# EAGLE design 11A-01 (EAGLE 6.3)
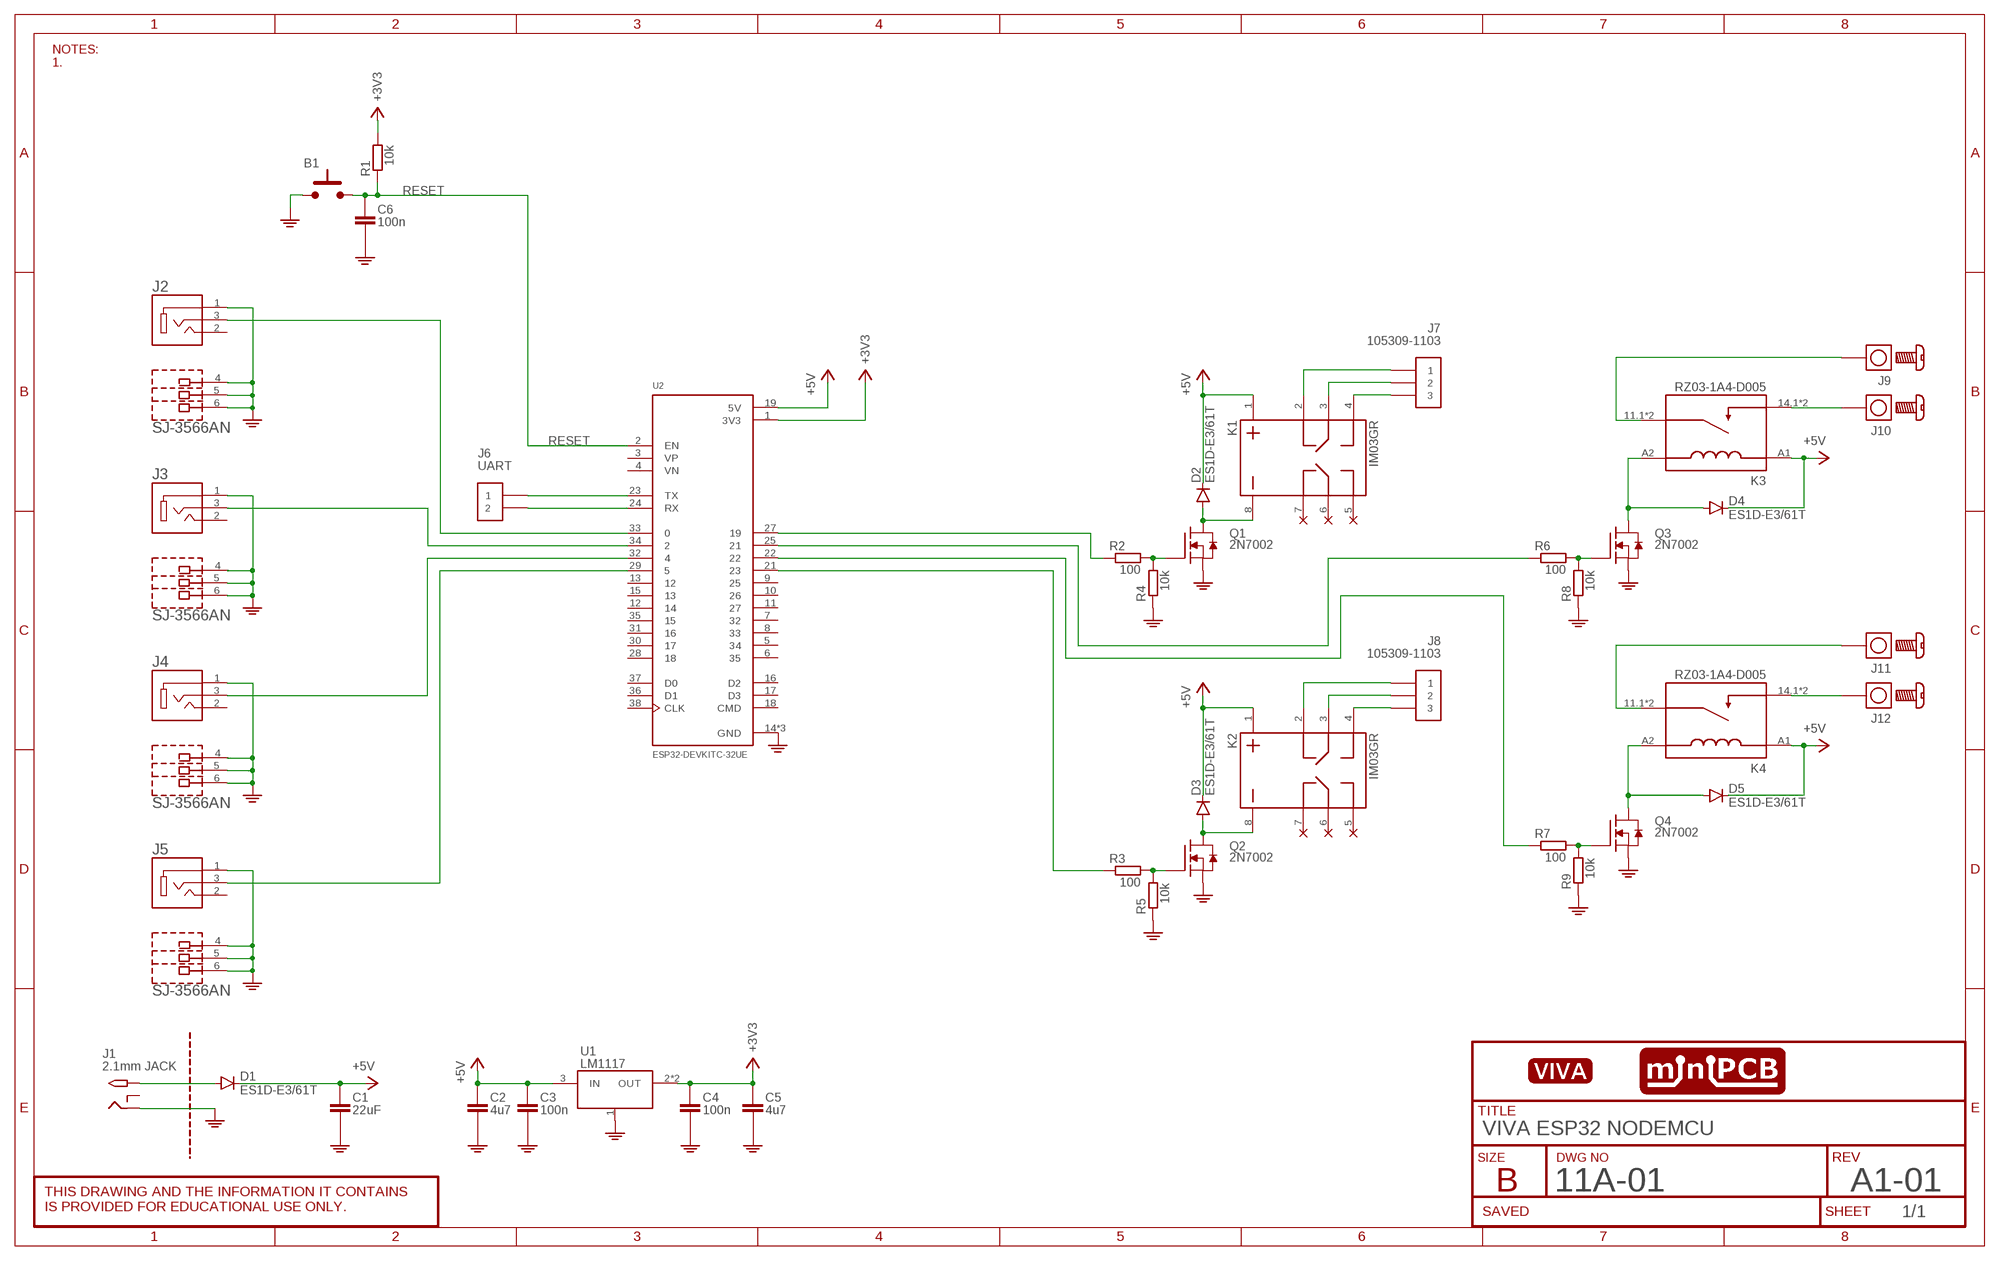
[diagram p0: schematic, sheet 1]
SHEET1 (SCHEMATIC): DWG_NO: 11A-01; REV: A1-01; TITLE: VIVA ESP32 NODEMCU

## Parts
B1  PUSHBUTTON6MMSMD  [PUSHBUTTON-6MM-SMD]
C1  22uF  CAPACITOR3.5MM  [C3-5MM]
C2  4u7  CAPACITORSMD  [C0805]
C3  100n  CAPACITORSMD  [C0805]
C4  100n  CAPACITORSMD  [C0805]
C5  4u7  CAPACITORSMD  [C0805]
C6  100n  CAPACITORSMD  [C0805]
D1  ES1D-E3/61T  DIODESMD  [DO214AC]
D2  ES1D-E3/61T  DIODESMD  [DO214AC]
D3  ES1D-E3/61T  DIODESMD  [DO214AC]
D4  ES1D-E3/61T  DIODESMD  [DO214AC]
D5  ES1D-E3/61T  DIODESMD  [DO214AC]
J1  2.1mm JACK  2.1MMJACKTHM  [PJ-102A]
J2  SJ-3566AN  [CUI_SJ-3566AN]
J3  SJ-3566AN  [CUI_SJ-3566AN]
J4  SJ-3566AN  [CUI_SJ-3566AN]
J5  SJ-3566AN  [CUI_SJ-3566AN]
J6  UART  PINS_2  [PINS_2]
J7  105309-1103  PINS_3-NANOFIT-105309-1103  [PINS_3-NANOFIT]
J8  105309-1103  PINS_3-NANOFIT-105309-1103  [PINS_3-NANOFIT]
J9  SCREW-TERMINAL  [SCREW-TERMINAL-M3]
J10  SCREW-TERMINAL  [SCREW-TERMINAL-M3]
J11  SCREW-TERMINAL  [SCREW-TERMINAL-M3]
J12  SCREW-TERMINAL  [SCREW-TERMINAL-M3]
K1  IM03GR  [RELAY_IM03GR]
K2  IM03GR  [RELAY_IM03GR]
K3  RZ03-1A4-D005  [RELAY_RZ03-1A4-D005]
K4  RZ03-1A4-D005  [RELAY_RZ03-1A4-D005]
PCB1  MINIPCB_0P100X100  [MINIPCB_DOCK_100X100]
Q1  2N7002  MOSFET-NSOT23  [SOT23]
Q2  2N7002  MOSFET-NSOT23  [SOT23]
Q3  2N7002  MOSFET-NSOT23  [SOT23]
Q4  2N7002  MOSFET-NSOT23  [SOT23]
R1  10k  RESISTORSMD  [R0805]
R2  100  RESISTORSMD  [R0805]
R3  100  RESISTORSMD  [R0805]
R4  10k  RESISTORSMD  [R0805]
R5  10k  RESISTORSMD  [R0805]
R6  100  RESISTORSMD  [R0805]
R7  100  RESISTORSMD  [R0805]
R8  10k  RESISTORSMD  [R0805]
R9  10k  RESISTORSMD  [R0805]
U1  LM1117  REGULATOR_SCHLM1117  [SOT223]
U2  ESP32-DEVKITC-32UE  [ESPRESSIF_ESP32-DEVKITC-32UE]
U$1  VIVA_LOGO  [VIVA_LOGO]

## Nets
+3V3: C4.1ASD(+) C5.1ASD(+) R1.2 U1.2(OUT) U1.4.TAB(OUT)
+5V: C1.+ C2.1ASD(+) C3.1ASD(+) D1.C D2.C D3.C D4.C D5.C K1.1 K2.1 K3.A1 K4.A1 U1.3(IN)
GND: B1.1 B1.2 C1.- C2.2ASDF(-) C3.2ASDF(-) C4.2ASDF(-) C5.2ASDF(-) C6.2ASDF(-) J1.RING J2.1 J2.5 J2.6 J3.1 J3.5 J3.6 J4.1 J4.5 J4.6 J5.1 J5.5 J5.6 Q1.2(S) Q2.2(S) Q3.2(S) Q4.2(S) R4.1 R5.1 R8.1 R9.1 U1.1(GND) U2.14(GND) U2.20(GND) U2.26(GND)
N$1: Q1.1(G) R2.2 R4.2
N$2: D4.A K3.A2 Q3.3(D)
N$3: Q3.1(G) R6.2 R8.2
N$4: J10.1 J10.2 J10.3 J10.4 K3.14.1 K3.14.2
N$5: J9.1 J9.2 J9.3 J9.4 K3.11.1 K3.11.2
N$6: D2.A K1.8 Q1.3(D)
N$7: D5.A K4.A2 Q4.3(D)
N$8: Q4.1(G) R7.2 R9.2
N$9: J12.1 J12.2 J12.3 J12.4 K4.14.1 K4.14.2
N$10: J11.1 J11.2 J11.3 J11.4 K4.11.1 K4.11.2
N$11: J7.3 K1.4
N$12: J7.2 K1.3
N$13: J7.1 K1.2
N$14: Q2.1(G) R3.2 R5.2
N$15: D3.A K2.8 Q2.3(D)
N$16: J8.3 K2.4
N$17: J8.2 K2.3
N$18: J8.1 K2.2
N$19: D1.A J1.TIP
N$20: J6.1 U2.23(TX)
N$21: J6.2 U2.24(RX)
N$22: J2.3 U2.33
N$23: J3.3 U2.34
N$24: J4.3 U2.32
N$25: J5.3 U2.29
N$26: R2.1 U2.27
N$27: R6.1 U2.25
N$28: R7.1 U2.22
N$29: R3.1 U2.21
RESET: B1.3 B1.4 C6.1ASD(+) R1.1 U2.2(EN)
Unconnected: J1.RING_SW J2.2 J2.4 J3.2 J3.4 J4.2 J4.4 J5.2 J5.4 K1.5 K1.6 K1.7 K2.5 K2.6 K2.7 U2.3(VP) U2.4(VN) U2.5 U2.6 U2.7 U2.8 U2.9 U2.10 U2.11 U2.12 U2.13 U2.15 U2.16(D2) U2.17(D3) U2.18(CMD) U2.28 U2.30 U2.31 U2.35 U2.36(D1) U2.37(D0) U2.38(CLK)

## Notes on the sheet
- NOTES:
  1.

## Power pins joined to a net without a drawn wire
3V3: U2.1(3V3)
5V: U2.19(5V)

## Library data of the parts
B1 = minipcb:PUSHBUTTON: Tactile push button switch
C1-C6 = minipcb:CAPACITOR
D1-D5 = minipcb:DIODE
J1 = utsa:2.1MMJACK: 2.1mm x 5.5mm THM DC jack with internal switch. Digikey part #PJ-102A, 4UCON part #05537 2.1mm x 5.5mm SMT DC jack with internal switch. Digikey part #PJ-002A-SMT, 4UCON part #03267 By microbuilder.eu & adafruit.com
J2-J5 = SJ-3566AN:SJ-3566AN: Audio Jack Connector 3.5 mm Right-Angle Stereo Jack w/ SPDT Switch Check availability <https://pricing.snapeda.com/parts/SJ-3566AN/Same%20Sky/view-part?ref=eda>; AVAILABILITY: In Stock; CHECK_PRICES: https://www.snapeda.com/parts/SJ-3566AN/Same+Sky/view-part/?ref=eda; DESCRIPTION: 3.5 mm Right-Angle, SPDT Switch, Stereo Audio Jack Connector; MF: Same Sky; MP: SJ-3566AN; PACKAGE: None; PRICE: None; SNAPEDA_LINK: https://www.snapeda.com/parts/SJ-3566AN/Same+Sky/view-part/?ref=snap
J6 = minipcb:PINS_2
J7 J8 = minipcb:PINS_3
J9-J12 = minipcb:SCREW-TERMINAL; CIRCUIT_CATEGORY: CIRCUIT CATEGORY; REVISION: A1; TITLE: TITLE
K1 K2 = IM03GR:IM03GR: Electromechanical Relay 5VDC 178Ohm 2A DPDT (( 10mm 7.5mm 5.65mm)) SMD Signal Relay Automotive Check availability <https://pricing.snapeda.com/parts/IM03GR/TE%20Connectivity%20Potter%20%26%20Brumfield%20Relays/view-part?ref=eda>; AVAILABILITY: In Stock; CHECK_PRICES: https://www.snapeda.com/parts/IM03GR/TE+Connectivity/view-part/?ref=eda; DESCRIPTION: Telecom Relay DPDT (2 Form C) Surface Mount; MF: TE Connectivity Potter & Brumfield Relays; MP: IM03GR; PACKAGE: None; PRICE: None; SNAPEDA_LINK: https://www.snapeda.com/parts/IM03GR/TE+Connectivity/view-part/?ref=snap
K3 K4 = RZ03-1A4-D005:RZ03-1A4-D005: Shrack; Relay Power PCB 16A SPST-NO 5VDC Check availability <https://pricing.snapeda.com/parts/RZ03-1A4-D005/TE%20Connectivity/view-part?ref=eda>; AVAILABILITY: In Stock; CHECK_PRICES: https://www.snapeda.com/parts/RZ03-1A4-D005/TE+Connectivity+Potter+%2526+Brumfield+Relays/view-part/?ref=eda; DESCRIPTION: Shrack, Relay Power PCB 16A SPST-NO 5VDC | TE Connectivity RZ03-1A4-D005; MF: TE Connectivity; MP: RZ03-1A4-D005; PACKAGE: None; PRICE: None; SNAPEDA_LINK: https://www.snapeda.com/parts/RZ03-1A4-D005/TE+Connectivity+Potter+%2526+Brumfield+Relays/view-part/?ref=snap
PCB1 = minipcb:MINIPCB_0P; CIRCUIT_CATEGORY: COMPUTING, EDUCATIONAL; PART_NUMBER: 11A-01; REVISION: A1-01; TITLE: VIVA ESP32 NODEMCU
Q1-Q4 = minipcb:MOSFET-N
R1-R9 = minipcb:RESISTOR
U1 = utsa:REGULATOR_SCH: Linear Regulator in SOT-223 package. NOTE: select correct pinout for your application. Tab may be OUT or GND!
U2 = ESP32-DEVKITC-32UE:ESP32-DEVKITC-32UE; MANUFACTURER: Espressif; MAXIMUM_PACKAGE_HEIGHT: N/A; PARTREV: V4; SNAPEDA_PN: ESP32-DEVKITC-32UE; STANDARD: Manufacturer Recommendations
U$1 = utsa:VIVA_LOGO

## Board
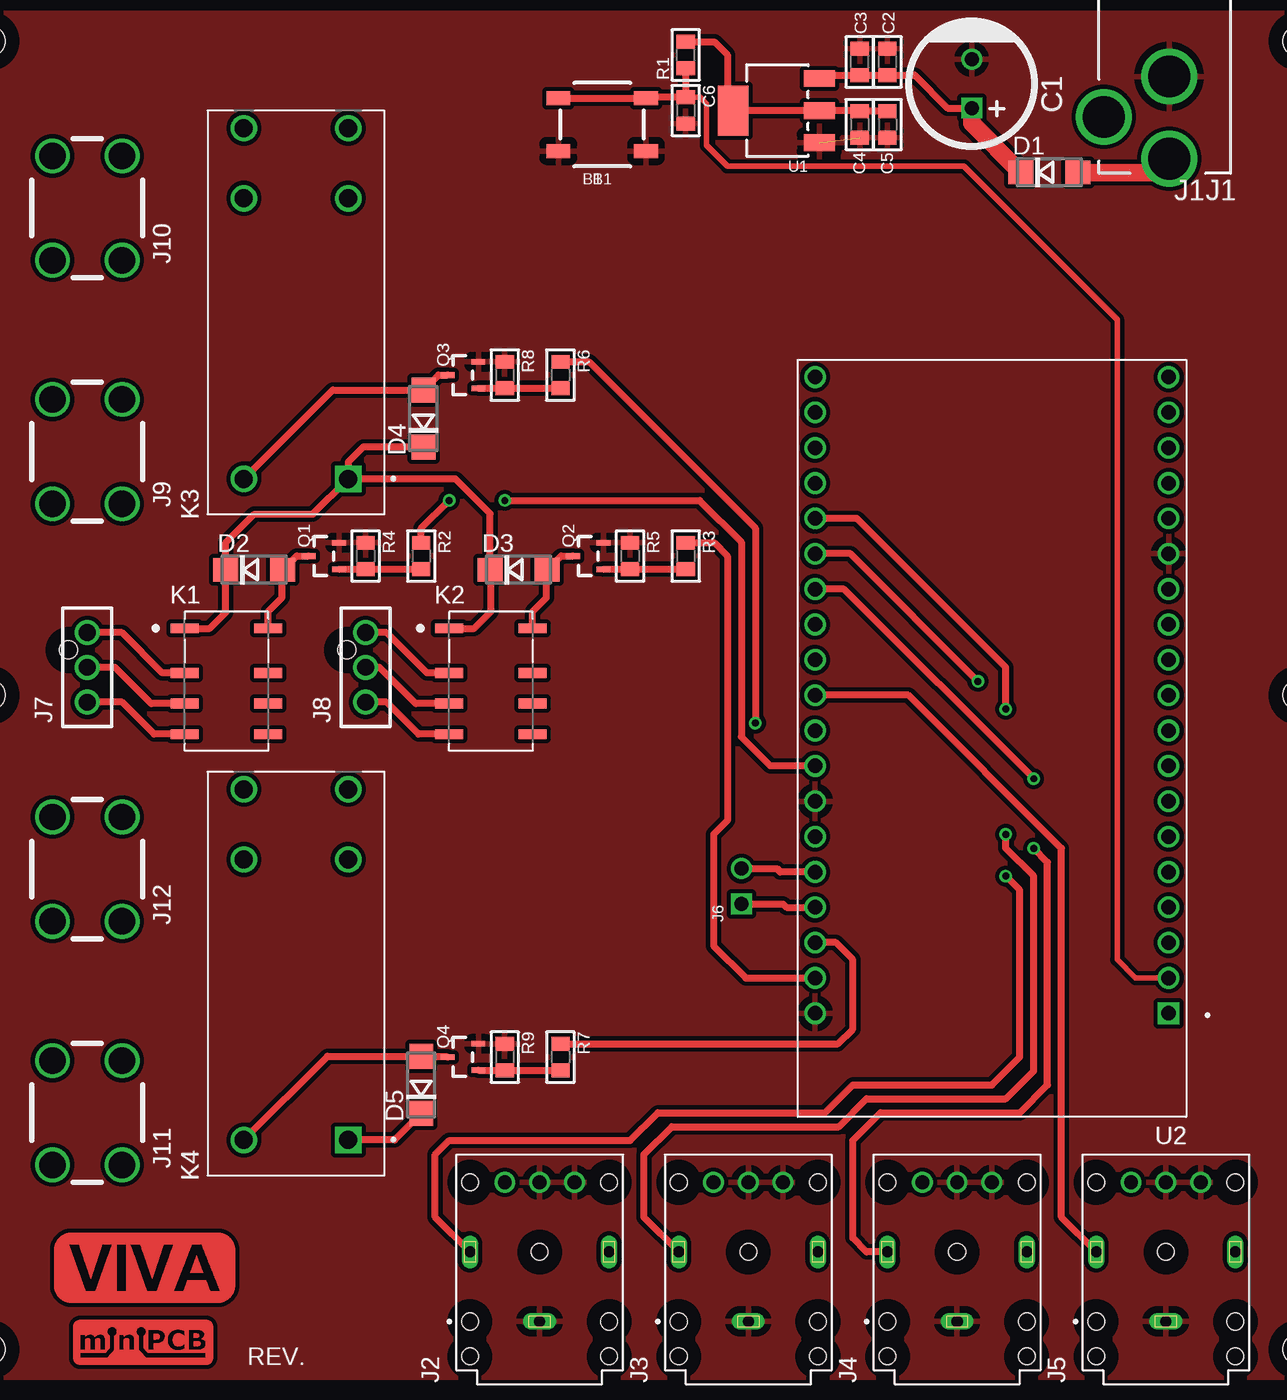
[diagram p1: board, top side]
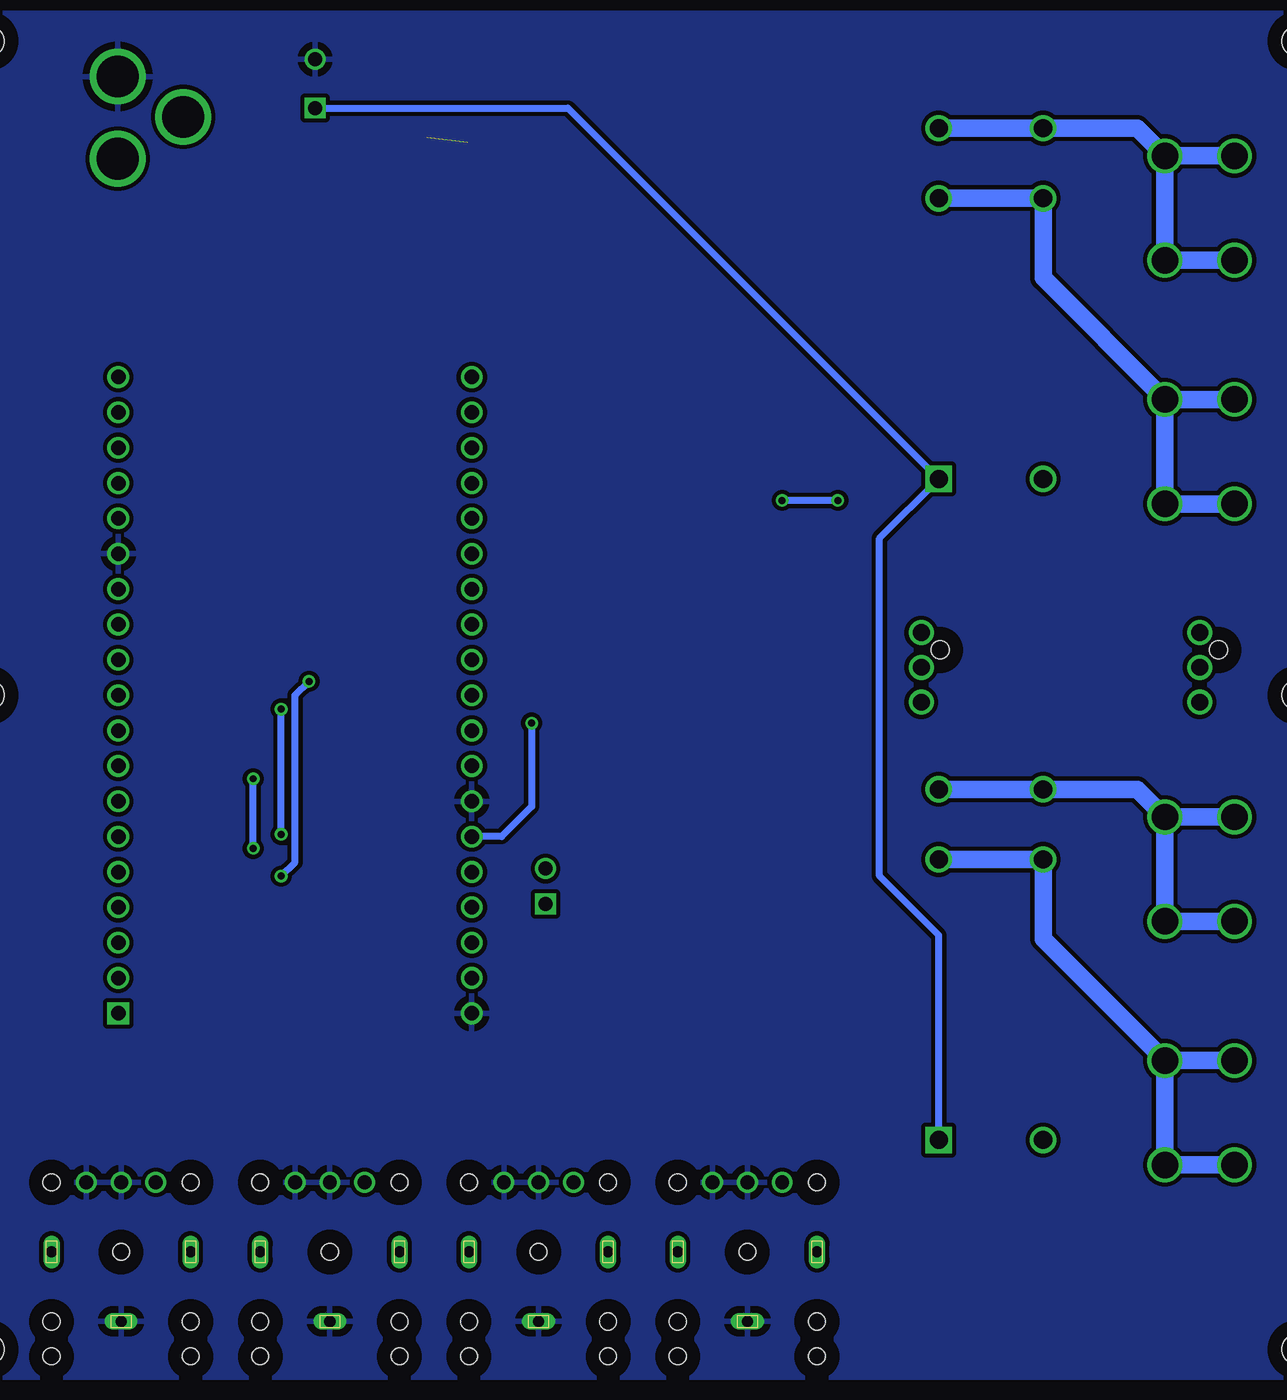
[diagram p2: board, bottom side, seen from below]

No outline drawn. Coordinates in mm, seen from the top.
Copper layers (1+2*15+16): Top 0.035mm / dielectric 0.15mm / Route2 0.035mm / dielectric 0.15mm / Route15 0.035mm / dielectric 0.2mm / Bottom 0.035mm
Design rules "minipcb-SMD": minimum track width 0.25mm, minimum drill 0.5mm, track to track 0.3mm, track to pad 0.3mm, pad to pad 0.15mm, via to via 0.3mm, smd to smd 0.15mm, copper to edge 1mm, drill to drill 1mm, minimum pad ring 0.2mm, minimum via ring 0.2mm, stop-mask expansion 0.1mm, vias tented up to drill 0.55mm, thermal gap 0.5mm

### Footprints (pad centres in the part's own frame; a part is rotated, then mirrored left to right if it is on the bottom)
PUSHBUTTON-6MM-SMD = smd 1.7 x 1: 1 -3.15,1.9; 2 3.15,1.9; 3 -3.15,-1.9; 4 3.15,-1.9
C3-5MM = drill 1 square: + -1.75,0 | drill 1: - 1.75,0
C0805 = smd 1 x 1.3: 1ASD -0.95,0; 2ASDF 0.95,0
DO214AC = smd 1.8 x 1.7: A 2.05,0; C -2.05,0
PJ-102A = drill 3 pad 4: RING 0.1,-3.39; RING_SW -4.6,-6.29; TIP 0.1,-9.29
CUI_SJ-3566AN = drill 0.8 long: 1 -5,0; 2 0,-5; 3 0,5 | drill 1: 4 5,2.5; 5 5,0; 6 5,-2.5 | hole 1.2: 5,5; 5,-5; 0,0; -5,5; -7.5,5; -5,-5; -7.5,-5
PINS_2 = drill 1 square: 1 0,0 | drill 1: 2 2.54,0
PINS_3-NANOFIT = drill 1.2: 1 -2.5,0; 2 0,0; 3 2.5,0 | hole 1.3: -1.25,-1.34
SCREW-TERMINAL-M3 = drill 1.9: 1 -2.5,3.75; 2 2.5,3.75; 3 -2.5,-3.75; 4 2.5,-3.75
RELAY_IM03GR = smd 2 x 0.7: 1 -3,3.8; 2 -3,0.6; 3 -3,-1.6; 4 -3,-3.8; 5 3,-3.8; 6 3,-1.6; 7 3,0.6; 8 3,3.8
RELAY_RZ03-1A4-D005 = drill 1.3: 11.1 8.2,-3.75; 11.2 8.2,3.75; 14.1 13.24,-3.75; 14.2 13.24,3.75; A2 -11.96,3.75 | drill 1.3 square: A1 -11.96,-3.75
MINIPCB_DOCK_100X100 = hole 2.2: 3,97; 3,50; 3,3; 97,3; 97,50; 97,97
SOT23 = smd 0.4 x 1: 1 -0.95,-1.1; 2 0.95,-1.1; 3 0,1.1
R0805 = smd 1 x 1.3: 1 -0.95,0; 2 0.95,0
SOT223 = smd 1.219 x 2.235: 1 -2.311,-3.099; 2 0,-3.099; 3 2.311,-3.099 | smd 3.6 x 2.2: 4.TAB 0,3.099
ESPRESSIF_ESP32-DEVKITC-32UE = drill 1.04 square: 1 -12.7,22.86 | drill 1.04: 2 -12.7,20.32; 3 -12.7,17.78; 4 -12.7,15.24; 5 -12.7,12.7; 6 -12.7,10.16; 7 -12.7,7.62; 8 -12.7,5.08; 9 -12.7,2.54; 10 -12.7,0; 11 -12.7,-2.54; 12 -12.7,-5.08; 13 -12.7,-7.62; 14 -12.7,-10.16; 15 -12.7,-12.7; 16 -12.7,-15.24; 17 -12.7,-17.78; 18 -12.7,-20.32; 19 -12.7,-22.86; 20 12.7,22.86; 21 12.7,20.32; 22 12.7,17.78; 23 12.7,15.24; 24 12.7,12.7; 25 12.7,10.16; 26 12.7,7.62; 27 12.7,5.08; 28 12.7,2.54; 29 12.7,0; 30 12.7,-2.54; 31 12.7,-5.08; 32 12.7,-7.62; 33 12.7,-10.16; 34 12.7,-12.7; 35 12.7,-15.24; 36 12.7,-17.78; 37 12.7,-20.32; 38 12.7,-22.86

### Placement (x,y rotation side)
B1  47,91 180 top
C1  73.55,93.94 90 top
C2  67.5,95.5 90 top
C3  65.5,95.5 90 top
C4  65.5,91 270 top
C5  67.5,91 270 top
C6  53,92 270 top
D1  79.13,87.56 0 top
D2  22,59 0 top
D3  41,59 0 top
D4  34.17,69.88 90 top
D5  34,22 90 top
J1  87.64,97.84 0 top
J2  42.5,10 90 top
J3  57.5,10 90 top
J4  72.5,10 90 top
J5  87.5,10 90 top
J6  57,35 90 top
J7  10,52 270 top
J8  30,52 270 top
J9  10,67.5 0 top
J10  10,85 0 top
J11  10,20 0 top
J12  10,37.5 0 top
K1  20,51 0 top
K2  39,51 0 top
K3  25,77.5 90 top
K4  25,30 90 top
PCB1  0,0 0 top
Q1  27,60 90 top
Q2  46,60 90 top
Q3  37,73 90 top
Q4  37,24 90 top
R1  53,96 90 top
R2  34,60 270 top
R3  53,60 270 top
R4  30,60 270 top
R5  49,60 270 top
R6  44,73 270 top
R7  44,24 270 top
R8  40,73 270 top
R9  40,24 270 top
U1  59.5,92 90 top
U2  75,50 180 top
U$1  7.62,6.35 0 top

### Tracks (layer width: path | path; a pad name or v marks a point on that pad's centre or on a via)
+3V3
  Top 0.5: C5.1ASD C4.1ASD 65.45,92 U1.2 U1.4.TAB 56,92.4 56,96 55.05,96.95 R1.2
+5V
  Top 0.5: K1.1 18.8,54.8 19.95,55.95 D2.C 19.95,60.95 22,63 26.21,63 K3.A1 | K2.1 37.8,54.8 39,56 39,58.95 D3.C 38.95,63.05 36.46,65.54 K3.A1 | D5.C 32.09,18.04 K4.A1 | D4.C 29.83,67.83 28.75,66.75 K3.A1 | U1.3 62.84,94.55 C3.1ASD C2.1ASD 69.45,94.55 71.81,92.19 C1.+
  Top 1.27: D1.C 73.55,91.09 C1.+
  Bottom 0.5: C1.+ 55.4,92.19 K3.A1 33,61.29 33,37 28.75,32.75 K4.A1
GND  (1 unrouted)
  pour Bottom: 1,1 99,1 99,99 1,99
  pour Top: 1,1 99,1 99,99 1,99
N$1
  Top 0.5: Q1.1 R4.2 R2.2
N$2
  Top 0.5: Q3.3 35.24,73 D4.A 27.64,71.93 K3.A2
N$3
  Top 0.5: Q3.1 R8.2 R6.2
N$4
  Bottom 1.27: J10.1 J10.2 | J10.3 J10.4 J10.2 | J10.2 14.49,90.74 K3.14.2 K3.14.1
N$5
  Bottom 1.27: J9.1 J9.2 | J9.3 J9.4 J9.2 | J9.2 21.25,80 K3.11.2 K3.11.1
N$6
  Top 0.5: K1.8 23,56 24,57 24,58.95 D2.A 25.05,60 Q1.3
N$7
  Top 0.5: K4.A2 27.26,24.05 D5.A 34,24 Q4.3
N$8
  Top 0.5: Q4.1 R9.2 R7.2
N$9
  Bottom 1.27: J12.1 J12.2 | J12.3 J12.4 J12.2 | J12.2 14.49,43.24 K4.14.2 K4.14.1
N$10
  Bottom 1.27: J11.1 J11.2 | J11.3 J11.4 J11.2 | J11.2 21.25,32.5 K4.11.2 K4.11.1
N$11
  Top 0.5: K1.4 14.8,47.2 12.5,49.5 J7.3
N$12
  Top 0.5: K1.3 14.6,49.4 12,52 J7.2
N$13
  Top 0.5: K1.2 15.4,51.6 12.5,54.5 J7.1
N$14
  Top 0.5: Q2.1 R5.2 R3.2
N$15
  Top 0.5: K2.8 42,56 43,57 43,58.95 D3.A 44.05,60 Q2.3
N$16
  Top 0.5: K2.4 33.8,47.2 31.5,49.5 J8.3
N$17
  Top 0.5: K2.3 33.6,49.4 31,52 J8.2
N$18
  Top 0.5: K2.2 34.4,51.6 31.5,54.5 J8.1
N$19
  Top 1.27: J1.TIP 86.75,87.56 D1.A
N$20
  Top 0.5: J6.1 60,35 60.24,34.76 U2.23
N$21
  Top 0.5: J6.2 59.54,37.54 59.78,37.3 U2.24
N$22  (via drill 0.5)
  Top 0.5: J2.3 35,12.5 35,17 36,18 49,18 51,20 63,20 65,22 75,22 77,24 77,36 v76,37 | v74,51 64.84,60.16 U2.33
  Bottom 0.5: v76,37 75,38 75,50 v74,51
N$23  (via drill 0.5)
  Top 0.5: J3.3 50,12.5 50,17 52,19 64,19 66,21 76,21 78,23 78,37 76,39 v76,40 | v76,49 76,52 65.3,62.7 U2.34
  Bottom 0.5: v76,40 v76,49
N$24  (via drill 0.5)
  Top 0.5: J4.3 66,10 65,11 65,18 67,20 77,20 79,22 79,38 v78,39 | v78,44 64.38,57.62 U2.32
  Bottom 0.5: v78,39 v78,44
N$25
  Top 0.5: J5.3 80,12.5 80,39 69,50 U2.29
N$26  (via drill 0.5)
  Top 0.5: R2.1 34,62 v36,64 | v40,64 54,64 57,61 57,47 59.08,44.92 U2.27
  Bottom 0.5: v36,64 v40,64
N$27  (via drill 0.5)
  Top 0.5: R6.1 46.05,73.95 58,62 v58,48
  Bottom 0.5: v58,48 58,42 60.16,39.84 U2.25
N$28
  Top 0.5: R7.1 63.95,24.95 65,26 65,31 63.78,32.22 U2.22
N$29
  Top 0.5: R3.1 55.05,60.95 56,60 56,41 55,40 55,32 57.32,29.68 U2.21
RESET
  Top 0.406: C6.1ASD 54.05,92.95 54.5,92.5 54.5,89.5 56,88 73,88 84,77 84,31 85.32,29.68 U2.2
  Top 0.5: R1.1 C6.1ASD 50.2,92.95 B1.3 B1.4

### Text on the board
_tNames: C3 | C2 | C1 | R1 | C6 | C4 | C5 | D1 | B1 | U1 | J1 | J10 | R8 | R6 | Q3 | D4 | J9 | K3 | R4 | R2 | R5 | R3 | Q1 | Q2 | D2 | D3 | K1 | K2 | J7 | J8 | J12 | J6 | R9 | R7 | Q4 | D5 | U2 | J11 | K4 | J2 | J3 | J4 | J5